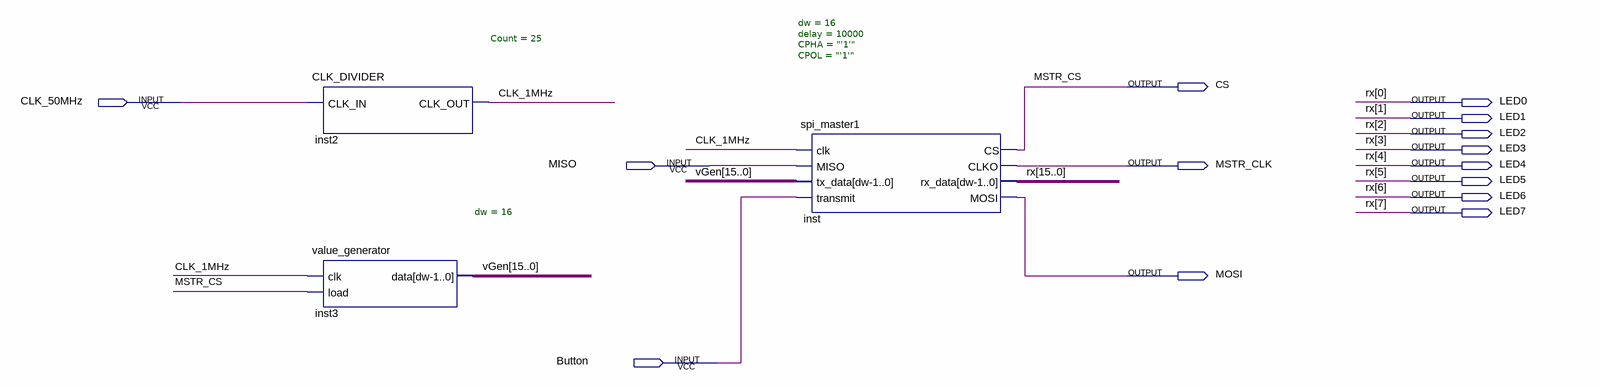
[diagram p0: schematic sheet]
// Quartus schematic spi_master.bdf as structural Verilog: 3 symbols, 14 pins
module spi_master (
  input  CLK_50MHz,
  input  MISO,
  input  Button,
  output CS,
  output LED0,
  output LED1,
  output LED2,
  output LED3,
  output MSTR_CLK,
  output LED4,
  output LED5,
  output LED6,
  output LED7,
  output MOSI
);

  wire CLK_1MHz;
  wire [15:0] vGen;
  wire [15:8] rx;

  CLK_DIVIDER #(.Count(25)) inst2 (.CLK_IN(CLK_50MHz), .CLK_OUT(CLK_1MHz));
  value_generator #(.dw(16)) inst3 (.clk(CLK_1MHz), .load(CS), .data(vGen));
  spi_master1 #(.dw(16), .delay(10000), .CPHA("'1'"), .CPOL("'1'")) inst (
    .clk(CLK_1MHz), .MISO(MISO), .tx_data(vGen), .transmit(Button), .CS(CS), .CLKO(MSTR_CLK),
    .rx_data({rx, LED7, LED6, LED5, LED4, LED3, LED2, LED1, LED0}), .MOSI(MOSI));

  // Other names for the same wires on the sheet: MSTR_CS = CS;
  //   rx[7:0] = {LED7, LED6, LED5, LED4, LED3, LED2, LED1, LED0}
endmodule
